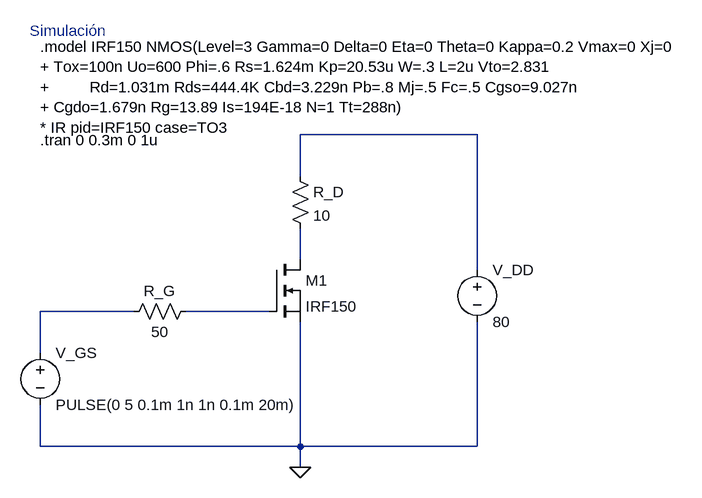
[diagram p0: schematic TPT4 - Mosfets de Potencia.asc]
TPT4 - Mosfets de Potencia.asc, the LTspice schematic file:
Version 4
SHEET 1 976 680
WIRE 576 -96 304 -96
WIRE 304 -32 304 -96
WIRE 304 96 304 48
WIRE 576 112 576 -96
WIRE 48 176 -96 176
WIRE 256 176 128 176
WIRE -96 240 -96 176
WIRE -96 384 -96 320
WIRE 304 384 304 192
WIRE 304 384 -96 384
WIRE 576 384 576 192
WIRE 576 384 304 384
WIRE 304 416 304 384
FLAG 304 416 0
SYMBOL voltage -96 224 R0
WINDOW 123 0 0 Left 0
WINDOW 39 0 0 Left 0
SYMATTR InstName V_GS
SYMATTR Value PULSE(0 5 0.1m 1n 1n 0.1m 20m)
SYMBOL nmos 256 96 R0
SYMATTR InstName M1
SYMATTR Value IRF150
SYMBOL res 144 160 R90
WINDOW 0 0 56 VBottom 2
WINDOW 3 32 56 VTop 2
SYMATTR InstName R_G
SYMATTR Value 50
SYMBOL res 288 -48 R0
SYMATTR InstName R_D
SYMATTR Value 10
SYMBOL voltage 576 96 R0
WINDOW 123 0 0 Left 0
WINDOW 39 0 0 Left 0
SYMATTR InstName V_DD
SYMATTR Value 80
TEXT -96 -232 Left 2 !.model IRF150 NMOS(Level=3 Gamma=0 Delta=0 Eta=0 Theta=0 Kappa=0.2 Vmax=0 Xj=0\n+ Tox=100n Uo=600 Phi=.6 Rs=1.624m Kp=20.53u W=.3 L=2u Vto=2.831\n+         Rd=1.031m Rds=444.4K Cbd=3.229n Pb=.8 Mj=.5 Fc=.5 Cgso=9.027n\n+ Cgdo=1.679n Rg=13.89 Is=194E-18 N=1 Tt=288n)\n* IR pid=IRF150 case=TO3
TEXT -112 -256 Left 2 ;Simulación
TEXT -96 -88 Left 2 !.tran 0 0.3m 0 1u

The netlist it stands for:
* TPT4 - Mosfets de Potencia.asc
V_GS N003 0 PULSE(0 5 0.1m 1n 1n 0.1m 20m)
M1 N002 N004 0 0 IRF150
R_G N004 N003 50
R_D N001 N002 10
V_DD N001 0 80
.model NMOS NMOS
.model PMOS PMOS
.lib standard.mos
.model IRF150 NMOS(Level=3 Gamma=0 Delta=0 Eta=0 Theta=0 Kappa=0.2 Vmax=0 Xj=0
+ Tox=100n Uo=600 Phi=.6 Rs=1.624m Kp=20.53u W=.3 L=2u Vto=2.831
+         Rd=1.031m Rds=444.4K Cbd=3.229n Pb=.8 Mj=.5 Fc=.5 Cgso=9.027n
+ Cgdo=1.679n Rg=13.89 Is=194E-18 N=1 Tt=288n)
* IR pid=IRF150 case=TO3
* Simulación
.tran 0 0.3m 0 1u
.backanno
.end